# Altium schematic sheet Interboard.SchDoc
size A4; SheetNumber: 2; SheetTotal: 5
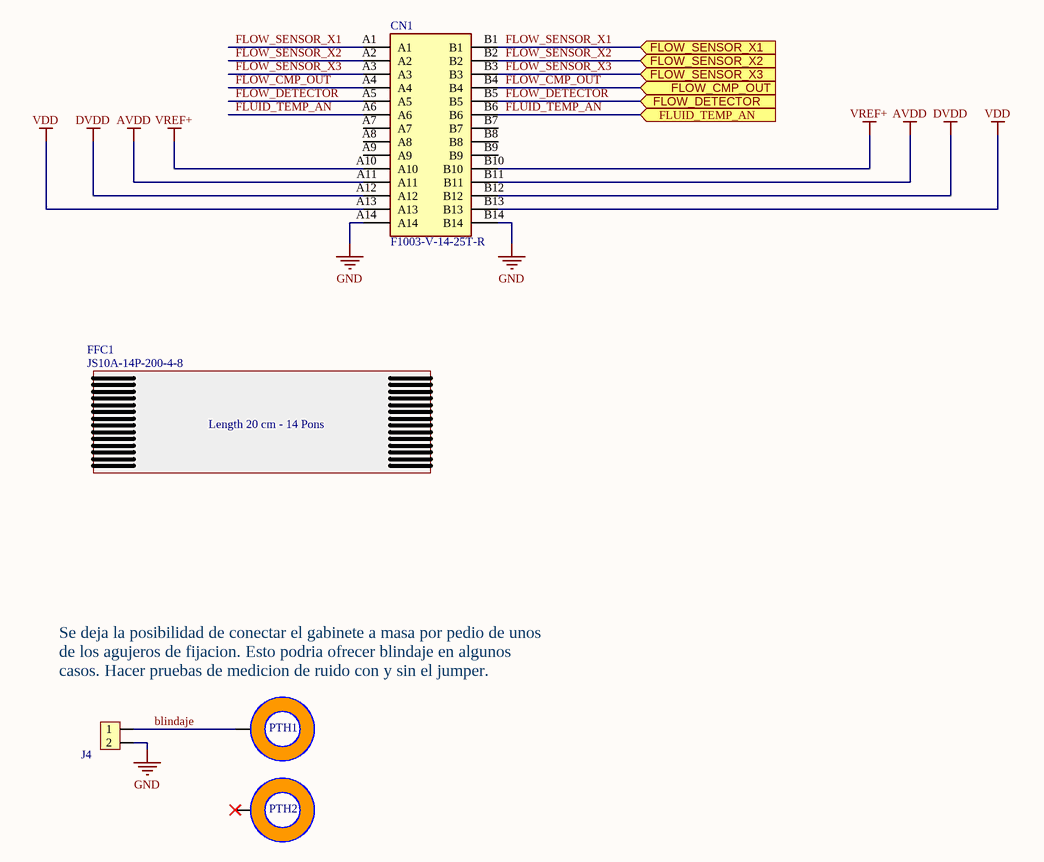
[diagram p0: Interboard.SchDoc]

## Parts
CN1  F1003-V-14-25T-R  [F1003-V-14-25T-R]
FFC1  JS10A-14P-200-4-8  [no_footprint]  (mechanical)
J4  54101-T0600LF-CUT-2  [HEADER PIN 1X2]  (value not drawn)
PTH1  PTH-3MM-L  [PTH_M3_L]  (value not drawn)  (no BOM)
PTH2  PTH-3MM-L  [PTH_M3_L]  (value not drawn)  (no BOM)

## Ports
FLOW_CMP_OUT (in), FLOW_DETECTOR (in), FLOW_SENSOR_X1 (in), FLOW_SENSOR_X2 (in), FLOW_SENSOR_X3 (in), FLUID_TEMP_AN (in)

## Nets
AVDD: CN1.A11 CN1.B11
DVDD: CN1.A12 CN1.B12
GND: CN1.A14 CN1.B14 J4.2
VDD: CN1.A13 CN1.B13
VREF+: CN1.A10 CN1.B10
blindaje: J4.1 PTH1.1
FLOW_CMP_OUT: CN1.A4 CN1.B4 ; port FLOW_CMP_OUT
FLOW_DETECTOR: CN1.A5 CN1.B5 ; port FLOW_DETECTOR
FLOW_SENSOR_X1: CN1.A1 CN1.B1 ; port FLOW_SENSOR_X1
FLOW_SENSOR_X2: CN1.A2 CN1.B2 ; port FLOW_SENSOR_X2
FLOW_SENSOR_X3: CN1.A3 CN1.B3 ; port FLOW_SENSOR_X3
FLUID_TEMP_AN: CN1.A6 CN1.B6 ; port FLUID_TEMP_AN

Not connected (* = marked no-connect by the designer): CN1 A7 A8 A9 B7 B8 B9; PTH2 1*

## Notes on the sheet
- Se deja la posibilidad de conectar el gabinete a masa por pedio de unos de los agujeros de fijacion. Esto podria ofrecer blindaje en algunos casos. Hacer pruebas de medicion de ruido con y sin el jumper.
- (in symbol JS10A-14P-200-4-8) Length 20 cm - 14 Pons

## Library data of the parts
CN1 = F1003-V-14-25T-R: 14 Position FFC, FPC Connector Contacts, Vertical - 1 Sided 0.039" (1.00mm) Surface Mount; Manufacturer: XFCN; Vendor Part Number: C2764805; Vendor: LCSC; Manufacturer Part Number: F1003-V-14-25T-R
FFC1 = JS10A-14P-200-4-8: Length 20 cm - 14 Pons - FFC flat flexible cable; Manufacturer: JXTCONN; Vendor Part Number: C2857589; Vendor: LCSC; PCBA: Off-board cable/wire – no PCB footprint. Please source and include in PCBA assembly; Manufacturer Part Number: JS10A-14P-200-4-8
J4 = 54101-T0600LF-CUT-2: Pin header pitch 2.54 TH - cuttable 2 od 36 positions.; Manufacturer: Amphenol ICC; Fraction: 2/36; Manufacturer Part Number: 54101-T0600LF; Vendor: *; Vendor Part Number: *
PTH1 PTH2 = PTH-3MM-L: Montaje M3. algo de holgura y buena corona.; Category: Mounting Hole; Temperature Max: -; Temperature Min: -